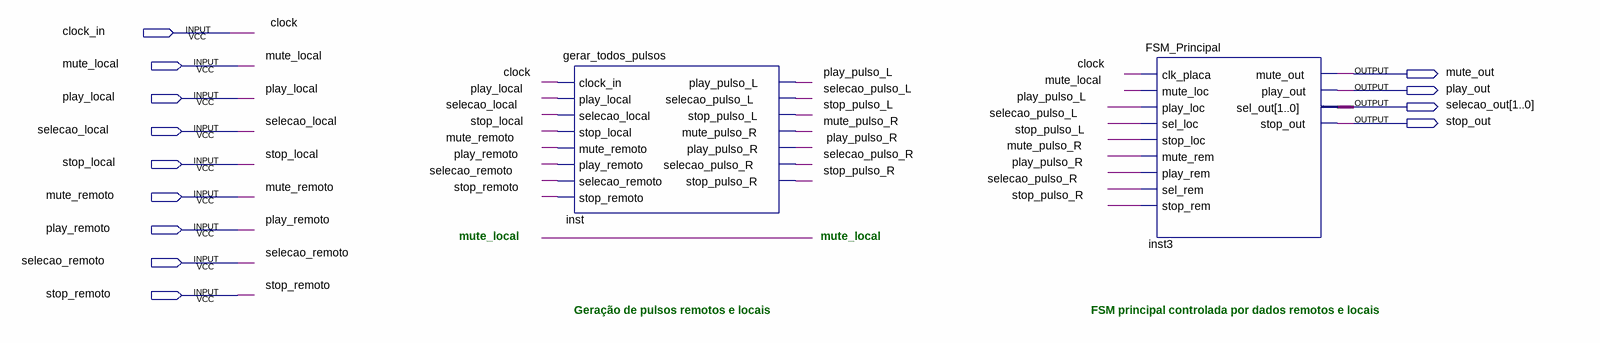
[diagram p0: schematic sheet]
// Quartus schematic Bloco_Controle_ReL.bdf as structural Verilog: 2 symbols, 13 pins
module Bloco_Controle_ReL (
  input  clock_in,
  input  mute_local,
  input  play_local,
  input  selecao_local,
  input  stop_local,
  input  mute_remoto,
  input  play_remoto,
  input  selecao_remoto,
  input  stop_remoto,
  output mute_out,
  output play_out,
  output [1:0] selecao_out,
  output stop_out
);

  wire mute_pulso_R, play_pulso_L, play_pulso_R, selecao_pulso_L, selecao_pulso_R, stop_pulso_L, stop_pulso_R;

  gerar_todos_pulsos inst (
    .clock_in(clock_in), .play_local(play_local), .selecao_local(selecao_local), .stop_local(stop_local),
    .mute_remoto(mute_remoto), .play_remoto(play_remoto), .selecao_remoto(selecao_remoto),
    .stop_remoto(stop_remoto), .play_pulso_L(play_pulso_L), .selecao_pulso_L(selecao_pulso_L),
    .stop_pulso_L(stop_pulso_L), .mute_pulso_R(mute_pulso_R), .play_pulso_R(play_pulso_R),
    .selecao_pulso_R(selecao_pulso_R), .stop_pulso_R(stop_pulso_R));
  FSM_Principal inst3 (
    .clk_placa(clock_in), .mute_loc(mute_local), .play_loc(play_pulso_L), .sel_loc(selecao_pulso_L),
    .stop_loc(stop_pulso_L), .mute_rem(mute_pulso_R), .play_rem(play_pulso_R), .sel_rem(selecao_pulso_R),
    .stop_rem(stop_pulso_R), .mute_out(mute_out), .play_out(play_out), .sel_out(selecao_out),
    .stop_out(stop_out));

  // Other names for the same wires on the sheet: clock = clock_in

  // Notes on the sheet:
  //   mute_local
  //   mute_local
  //   Geração de pulsos remotos e locais
  //   FSM principal controlada por dados remotos e locais
endmodule
